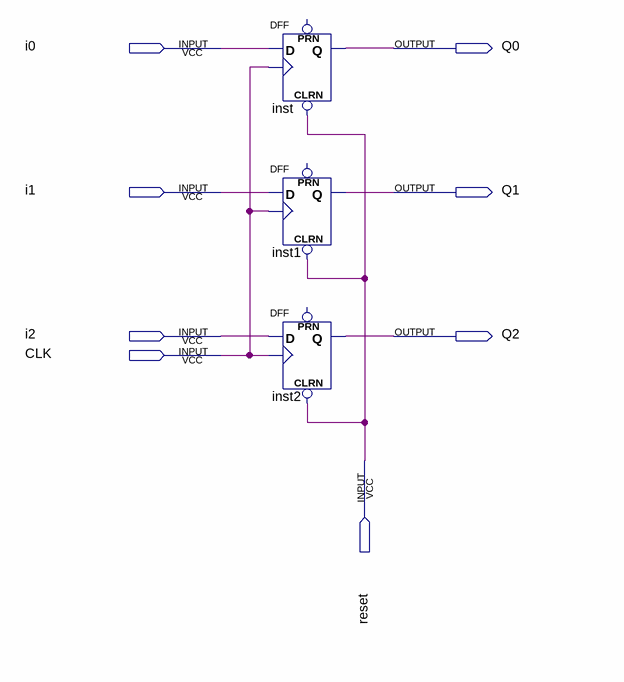
[diagram p0: schematic sheet]
// Quartus schematic dff3bit.bdf as structural Verilog: 3 symbols, 8 pins
module dff3bit (
  input  i0,
  input  i1,
  input  i2,
  input  CLK,
  input  reset,
  output Q0,
  output Q1,
  output Q2
);

  DFF inst (.CLRN(reset), .CLK(CLK), .D(i0), .Q(Q0));  // open: PRN
  DFF inst1 (.CLRN(reset), .CLK(CLK), .D(i1), .Q(Q1));  // open: PRN
  DFF inst2 (.CLRN(reset), .CLK(CLK), .D(i2), .Q(Q2));  // open: PRN
endmodule
